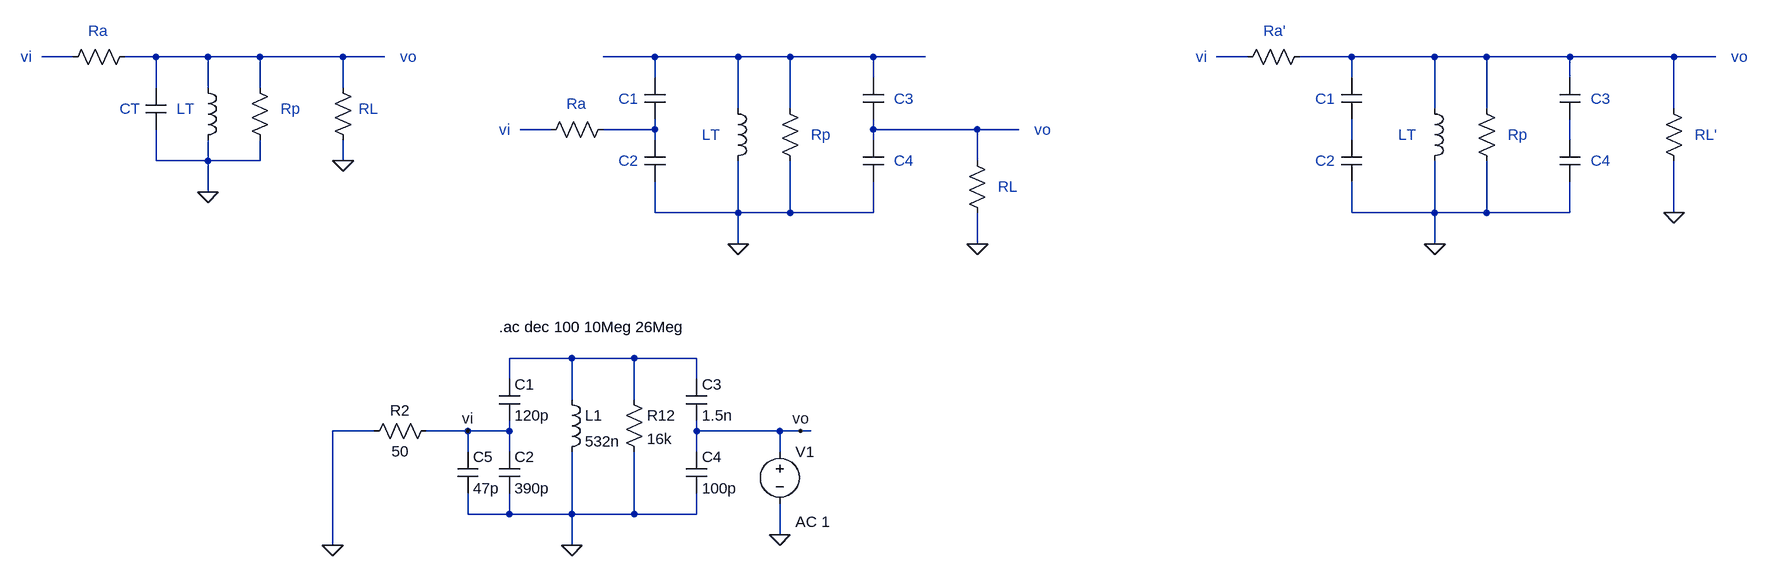
[diagram p0: schematic acopleLC.asc]
acopleLC.asc, the LTspice schematic file:
Version 4
SHEET 1 1768 680
WIRE -816 -432 -864 -432
WIRE -688 -432 -736 -432
WIRE -608 -432 -688 -432
WIRE -528 -432 -608 -432
WIRE -400 -432 -528 -432
WIRE -336 -432 -400 -432
WIRE 80 -432 0 -432
WIRE 208 -432 80 -432
WIRE 288 -432 208 -432
WIRE 416 -432 288 -432
WIRE 496 -432 416 -432
WIRE 992 -432 944 -432
WIRE 1152 -432 1072 -432
WIRE 1280 -432 1152 -432
WIRE 1360 -432 1280 -432
WIRE 1488 -432 1360 -432
WIRE 1648 -432 1488 -432
WIRE 1712 -432 1648 -432
WIRE 80 -400 80 -432
WIRE 416 -400 416 -432
WIRE 1152 -400 1152 -432
WIRE 1488 -400 1488 -432
WIRE -688 -384 -688 -432
WIRE -608 -384 -608 -432
WIRE -528 -384 -528 -432
WIRE -400 -384 -400 -432
WIRE 208 -352 208 -432
WIRE 288 -352 288 -432
WIRE 1280 -352 1280 -432
WIRE 1360 -352 1360 -432
WIRE 1648 -352 1648 -432
WIRE -80 -320 -128 -320
WIRE 80 -320 80 -336
WIRE 80 -320 0 -320
WIRE 416 -320 416 -336
WIRE 576 -320 416 -320
WIRE 640 -320 576 -320
WIRE 80 -304 80 -320
WIRE 416 -304 416 -320
WIRE 1152 -304 1152 -336
WIRE 1488 -304 1488 -336
WIRE -688 -272 -688 -320
WIRE -608 -272 -608 -304
WIRE -608 -272 -688 -272
WIRE -528 -272 -528 -304
WIRE -528 -272 -608 -272
WIRE -400 -272 -400 -304
WIRE 576 -272 576 -320
WIRE -608 -224 -608 -272
WIRE 80 -192 80 -240
WIRE 208 -192 208 -272
WIRE 208 -192 80 -192
WIRE 288 -192 288 -272
WIRE 288 -192 208 -192
WIRE 416 -192 416 -240
WIRE 416 -192 288 -192
WIRE 1152 -192 1152 -240
WIRE 1280 -192 1280 -272
WIRE 1280 -192 1152 -192
WIRE 1360 -192 1360 -272
WIRE 1360 -192 1280 -192
WIRE 1488 -192 1488 -240
WIRE 1488 -192 1360 -192
WIRE 1648 -192 1648 -272
WIRE 208 -144 208 -192
WIRE 576 -144 576 -192
WIRE 1280 -144 1280 -192
WIRE -48 32 -144 32
WIRE 48 32 -48 32
WIRE 144 32 48 32
WIRE -144 64 -144 32
WIRE 144 64 144 32
WIRE -48 96 -48 32
WIRE 48 96 48 32
WIRE -352 144 -416 144
WIRE -208 144 -272 144
WIRE -144 144 -144 128
WIRE -144 144 -208 144
WIRE 144 144 144 128
WIRE 272 144 144 144
WIRE 304 144 272 144
WIRE 320 144 304 144
WIRE -208 176 -208 144
WIRE -144 176 -144 144
WIRE 144 176 144 144
WIRE 272 176 272 144
WIRE -208 272 -208 240
WIRE -144 272 -144 240
WIRE -144 272 -208 272
WIRE -48 272 -48 176
WIRE -48 272 -144 272
WIRE 48 272 48 176
WIRE 48 272 -48 272
WIRE 144 272 144 240
WIRE 144 272 48 272
WIRE 272 304 272 256
WIRE -416 320 -416 144
WIRE -48 320 -48 272
FLAG 272 304 0
FLAG -48 320 0
FLAG -416 320 0
FLAG -608 -224 0
FLAG -400 -272 0
FLAG 208 -144 0
FLAG 576 -144 0
FLAG 1280 -144 0
FLAG 1648 -192 0
FLAG 304 144 vo
FLAG -208 144 vi
SYMBOL ind -64 80 R0
SYMATTR InstName L1
SYMATTR Value 532n
SYMBOL cap -160 64 R0
SYMATTR InstName C1
SYMATTR Value 120p
SYMBOL cap -160 176 R0
SYMATTR InstName C2
SYMATTR Value 390p
SYMBOL cap 128 64 R0
SYMATTR InstName C3
SYMATTR Value 1.5n
SYMBOL cap 128 176 R0
SYMATTR InstName C4
SYMATTR Value 100p
SYMBOL res -256 128 R90
WINDOW 0 0 56 VBottom 2
WINDOW 3 32 56 VTop 2
SYMATTR InstName R2
SYMATTR Value 50
SYMBOL voltage 272 160 R0
WINDOW 123 24 124 Left 2
WINDOW 39 0 0 Left 0
SYMATTR Value2 AC 1
SYMATTR InstName V1
SYMATTR Value ""
SYMBOL cap -224 176 R0
SYMATTR InstName C5
SYMATTR Value 47p
SYMBOL res -720 -448 R90
WINDOW 0 0 56 Invisible 2
WINDOW 3 32 56 Invisible 2
SYMATTR InstName R3
SYMATTR Value 1
SYMBOL cap -704 -384 R0
WINDOW 0 24 8 Invisible 2
WINDOW 3 24 56 Invisible 2
SYMATTR InstName C7
SYMATTR Value 1
SYMBOL ind -624 -400 R0
WINDOW 0 36 40 Invisible 2
WINDOW 3 36 80 Invisible 2
SYMATTR InstName L2
SYMATTR Value 1
SYMBOL res -544 -400 R0
WINDOW 0 51 54 Invisible 2
WINDOW 3 36 76 Invisible 2
SYMATTR InstName R4
SYMATTR Value 1
SYMBOL res -416 -400 R0
WINDOW 0 51 54 Invisible 2
WINDOW 3 36 76 Invisible 2
SYMATTR InstName R5
SYMATTR Value 1
SYMBOL res 16 -336 R90
WINDOW 0 0 56 Invisible 2
WINDOW 3 32 56 Invisible 2
SYMATTR InstName R6
SYMATTR Value 1
SYMBOL cap 64 -304 R0
WINDOW 0 24 8 Invisible 2
WINDOW 3 24 56 Invisible 2
SYMATTR InstName C8
SYMATTR Value 1
SYMBOL ind 192 -368 R0
WINDOW 0 36 40 Invisible 2
WINDOW 3 36 80 Invisible 2
SYMATTR InstName L3
SYMATTR Value 1
SYMBOL res 272 -368 R0
WINDOW 0 51 54 Invisible 2
WINDOW 3 36 76 Invisible 2
SYMATTR InstName R7
SYMATTR Value 1
SYMBOL res 560 -288 R0
WINDOW 0 51 54 Invisible 2
WINDOW 3 36 76 Invisible 2
SYMATTR InstName R8
SYMATTR Value 1
SYMBOL cap 64 -400 R0
WINDOW 0 24 8 Invisible 2
WINDOW 3 24 56 Invisible 2
SYMATTR InstName C9
SYMATTR Value 1
SYMBOL cap 400 -304 R0
WINDOW 0 24 8 Invisible 2
WINDOW 3 24 56 Invisible 2
SYMATTR InstName C10
SYMATTR Value 1
SYMBOL cap 400 -400 R0
WINDOW 0 24 8 Invisible 2
WINDOW 3 24 56 Invisible 2
SYMATTR InstName C11
SYMATTR Value 1
SYMBOL res 1088 -448 R90
WINDOW 0 0 56 Invisible 2
WINDOW 3 32 56 Invisible 2
SYMATTR InstName R9
SYMATTR Value 1
SYMBOL cap 1136 -304 R0
WINDOW 0 24 8 Invisible 2
WINDOW 3 24 56 Invisible 2
SYMATTR InstName C12
SYMATTR Value 1
SYMBOL ind 1264 -368 R0
WINDOW 0 36 40 Invisible 2
WINDOW 3 36 80 Invisible 2
SYMATTR InstName L4
SYMATTR Value 1
SYMBOL res 1344 -368 R0
WINDOW 0 51 54 Invisible 2
WINDOW 3 36 76 Invisible 2
SYMATTR InstName R10
SYMATTR Value 1
SYMBOL res 1632 -368 R0
WINDOW 0 51 54 Invisible 2
WINDOW 3 36 76 Invisible 2
SYMATTR InstName R11
SYMATTR Value 1
SYMBOL cap 1136 -400 R0
WINDOW 0 24 8 Invisible 2
WINDOW 3 24 56 Invisible 2
SYMATTR InstName C13
SYMATTR Value 1
SYMBOL cap 1472 -304 R0
WINDOW 0 24 8 Invisible 2
WINDOW 3 24 56 Invisible 2
SYMATTR InstName C14
SYMATTR Value 1
SYMBOL cap 1472 -400 R0
WINDOW 0 24 8 Invisible 2
WINDOW 3 24 56 Invisible 2
SYMATTR InstName C15
SYMATTR Value 1
SYMBOL res 32 80 R0
SYMATTR InstName R12
SYMATTR Value 16k
TEXT -160 -16 Left 2 !.ac dec 100 10Meg 26Meg
TEXT -792 -472 Left 2 ;Ra
TEXT -744 -352 Left 2 ;CT
TEXT -656 -352 Left 2 ;LT
TEXT -496 -352 Left 2 ;Rp
TEXT -896 -432 Left 2 ;vi
TEXT -312 -432 Left 2 ;vo
TEXT -376 -352 Left 2 ;RL
TEXT -56 -360 Left 2 ;Ra
TEXT 152 -312 Left 2 ;LT
TEXT 320 -312 Left 2 ;Rp
TEXT -160 -320 Left 2 ;vi
TEXT 664 -320 Left 2 ;vo
TEXT 608 -232 Left 2 ;RL
TEXT 24 -368 Left 2 ;C1
TEXT 24 -272 Left 2 ;C2
TEXT 448 -368 Left 2 ;C3
TEXT 448 -272 Left 2 ;C4
TEXT 1016 -472 Left 2 ;Ra'
TEXT 1224 -312 Left 2 ;LT
TEXT 1392 -312 Left 2 ;Rp
TEXT 912 -432 Left 2 ;vi
TEXT 1736 -432 Left 2 ;vo
TEXT 1680 -312 Left 2 ;RL'
TEXT 1096 -368 Left 2 ;C1
TEXT 1096 -272 Left 2 ;C2
TEXT 1520 -368 Left 2 ;C3
TEXT 1520 -272 Left 2 ;C4

The netlist it stands for:
* acopleLC.asc
L1 N011 0 532n
C1 N011 vi 120p
C2 vi 0 390p
C3 N011 vo 1.5n
C4 vo 0 100p
R2 vi 0 50
V1 vo 0 AC 1
C5 vi 0 47p
R3 N002 N001 1
C7 N002 0 1
L2 N002 0 1
R4 N002 0 1
R5 N002 0 1
R6 N007 N006 1
C8 N007 0 1
L3 N003 0 1
R7 N003 0 1
R8 N008 0 1
C9 N003 N007 1
C10 N008 0 1
C11 N003 N008 1
R9 N005 N004 1
C12 N009 0 1
L4 N005 0 1
R10 N005 0 1
R11 N005 0 1
C13 N005 N009 1
C14 N010 0 1
C15 N005 N010 1
R12 N011 0 16k
.ac dec 100 10Meg 26Meg
* Ra
* CT
* LT
* Rp
* vi
* vo
* RL
* Ra
* LT
* Rp
* vi
* vo
* RL
* C1
* C2
* C3
* C4
* Ra'
* LT
* Rp
* vi
* vo
* RL'
* C1
* C2
* C3
* C4
.backanno
.end